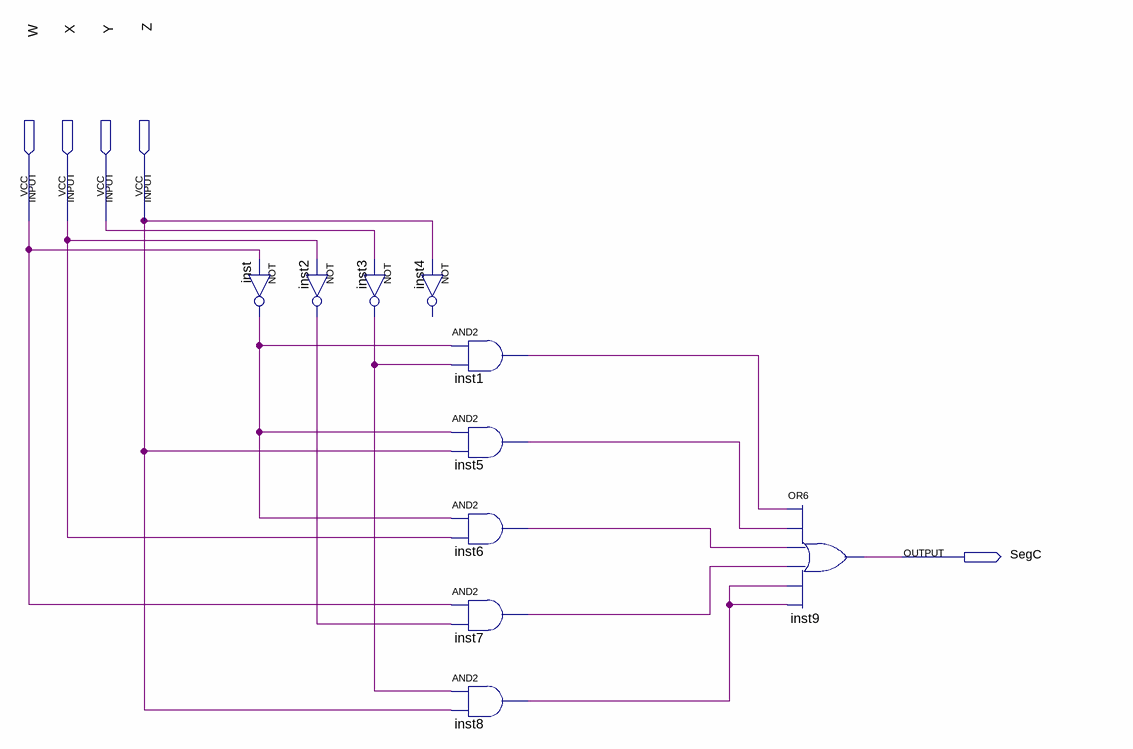
[diagram p0: schematic sheet]
// Quartus schematic SegC.bdf as structural Verilog: 10 symbols, 5 pins
module SegC (
  input  W,
  input  X,
  input  Y,
  input  Z,
  output SegC
);

  wire inst1_out, inst2_out, inst3_out, inst5_out, inst6_out, inst7_out, inst8_out, inst_out;

  not inst (inst_out, W);
  not inst2 (inst2_out, X);
  not inst3 (inst3_out, Y);
  // NOT inst4 has open pins: IN=Z, OUT=open
  and inst1 (inst1_out, inst_out, inst3_out);
  and inst5 (inst5_out, inst_out, Z);
  and inst6 (inst6_out, inst_out, X);
  and inst7 (inst7_out, W, inst2_out);
  and inst8 (inst8_out, inst3_out, Z);
  or inst9 (SegC, inst1_out, inst5_out, inst6_out, inst7_out, inst8_out, inst8_out);
endmodule
